# Altium schematic sheet fisico_frente.SchDoc
size 127 x 101 mm; PageSetup: Record=PageOptions|CenterHorizontal=True|CenterVertical=True|PrintScale=1.05|XCorrection=1.00|YCorrection=1.00|PrintKind=0|BorderSize=5000000|LeftOffset=0|BottomOffset=0|Orientation=2|PaperLength=1000|PaperWidth=1000|Scale=100|PaperSource=7|PrintQuality=-4|MediaType=1|DitherType=10|PaperKind=A4 (8.2 x 11.7 in; 210 x 297 mm)|PrintScaleMode=1
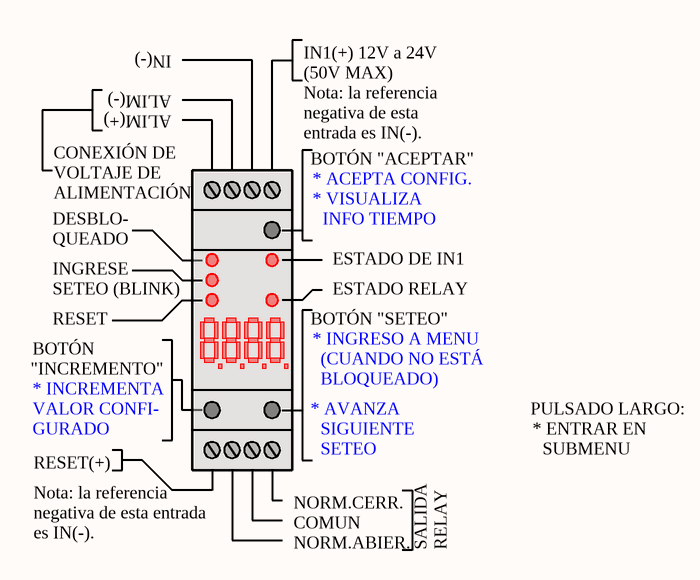
[diagram p0: fisico_frente.SchDoc]

## Notes on the sheet
- ALIM(-)
- ALIM(+)
- IN(-)
- IN1(+) 12V a 24V (50V MAX)
- CONEXIÓN DE VOLTAJE DE ALIMENTACIÓN
- DESBLO-
- Nota: la referencia negativa de esta entrada es IN(-).
- BOTÓN "ACEPTAR"
- * ACEPTA CONFIG.
- * VISUALIZA
- INFO TIEMPO
- QUEADO
- INGRESE
- SETEO (BLINK)
- RESET
- BOTÓN "SETEO"
- * INGRESO A MENU
- ESTADO RELAY
- ESTADO DE IN1
- "INCREMENTO"
- BOTÓN
- * INCREMENTA
- VALOR CONFI-
- GURADO
- * AVANZA
- (CUANDO NO ESTÁ
- BLOQUEADO)
- SIGUIENTE
- PULSADO LARGO:
- * ENTRAR EN
- RESET(+)
- NORM.CERR.
  COMUN
  NORM.ABIER.
- SETEO
- SALIDA
- RELAY
- SUBMENU